# Altium schematic sheet STM3205P_Connectors.SchDoc
size A3; Organization: Canis Tech; Address1: -; Address2: -; Address3: -; Address4: Indaiatuba/SP; DocumentNumber: 2; SheetNumber: 2; SheetTotal: 9; Address5: Brazil
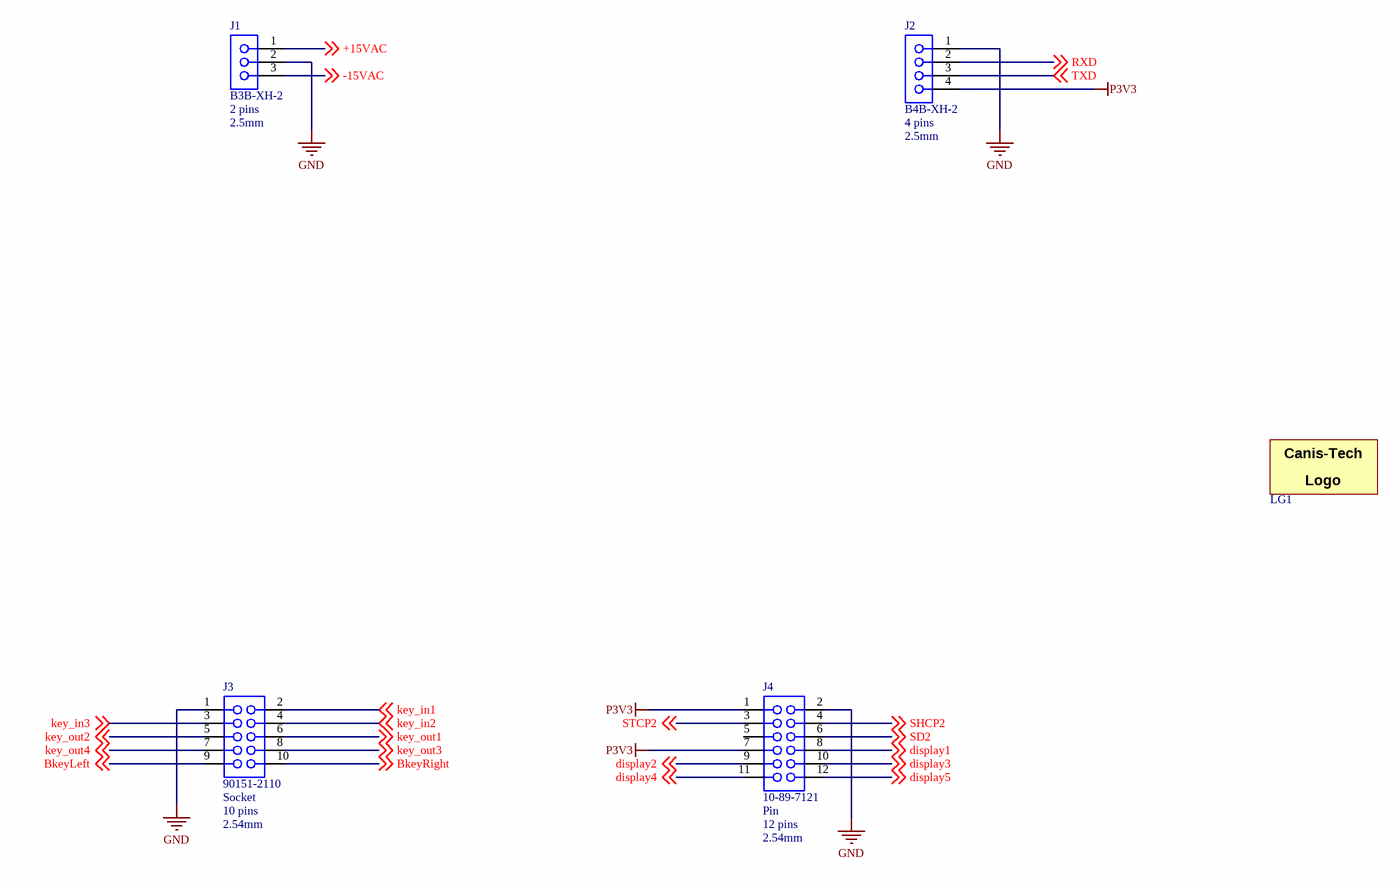
[diagram p0: STM3205P_Connectors.SchDoc]

## Parts
J1  Pins: 2 pins  Pitch: 2.5mm  [CONXH03STRMALE_2.5]  (hidden comment: B3B-XH-2)
J2  Pins: 4 pins  Pitch: 2.5mm  [CONXH04STRMALE_2.5]  (hidden comment: B4B-XH-2)
J3  Type: Socket  Pins: 10 pins  Pitch: 2.54mm  [CONDIL10STRFEMALE_100_100]  (hidden comment: 90151-2110)
J4  Type: Pin  Pins: 12 pins  Pitch: 2.54mm  [CONDIL12STRMALE_100_100]  (hidden comment: 10-89-7121)
LG1  Canis-Tech Logo  [CT Logo 400th]  (value not drawn)  (no BOM)

## Nets
GND: J1.2 J2.1 J3.1 J4.2
P3V3: J2.4 J4.1 J4.7
+15VAC: J1.1 ; off-sheet +15VAC
-15VAC: J1.3 ; off-sheet -15VAC
BkeyLeft: J3.9 ; off-sheet BkeyLeft
BkeyRight: J3.10 ; off-sheet BkeyRight
display1: J4.8 ; off-sheet display1
display2: J4.9 ; off-sheet display2
display3: J4.10 ; off-sheet display3
display4: J4.11 ; off-sheet display4
display5: J4.12 ; off-sheet display5
key_in1: J3.2 ; off-sheet key_in1
key_in2: J3.4 ; off-sheet key_in2
key_in3: J3.3 ; off-sheet key_in3
key_out1: J3.6 ; off-sheet key_out1
key_out2: J3.5 ; off-sheet key_out2
key_out3: J3.8 ; off-sheet key_out3
key_out4: J3.7 ; off-sheet key_out4
RXD: J2.2 ; off-sheet RXD
SD2: J4.6 ; off-sheet SD2
SHCP2: J4.4 ; off-sheet SHCP2
STCP2: J4.3 ; off-sheet STCP2
TXD: J2.3 ; off-sheet TXD

Not connected (* = marked no-connect by the designer): J4 5

## Notes on the sheet
- Title
- Author
- Checked By
- Variant
- Size:
- Revision:
- A3
- Date:
- Project
- Time:
- Sheet
- of
- File:
- (in symbol Canis-Tech Logo) Canis-Tech; Logo

## Library data of the parts
J1 = B3B-XH-2: XH Connector 3 POS HDR VERT 2.5mm; Manufacturer1: JST; LastRevisionNote: Created; Gender: Male; Published: 04-Oct-2025; LatestRevisionDate: 04-Oct-2025; PackageReference: CONXH03STRMALE_2.5; Publisher: Lucas Moraes; PackageDescription: CONXH03STRMALE_2.5; 3 Leads; Type: Pin; PartNumber1: B3B-XH-2
J2 = B4B-XH-2: XH Connector 4 POS HDR VERT 2.5mm; Manufacturer1: JST; LastRevisionNote: Created; Gender: Male; Published: 04-Oct-2025; LatestRevisionDate: 04-Oct-2025; PackageReference: CONXH04STRMALE_2.5; Publisher: Lucas Moraes; PackageDescription: CONXH04STRMALE_2.5; 4 Leads; Type: Pin; PartNumber1: B4B-XH-2
J3 = 90151-2110: Headers & Wire Housings C-Grid PCB Conn Dual Row Vertical 10Ckt; Manufacturer1: Molex; LastRevisionNote: Created; Gender: Female; Direction: 90; Published: 03-Jan-2025; LatestRevisionDate: 03-Jan-2025; PackageReference: CONDIL10STRFEMALE_100_100; Publisher: Lucas Moraes; PackageDescription: CONDIL10STRFEMALE_100_100; 10 Leads; PartNumber1: 90151-2110
J4 = 10-89-7121: Headers & Wire Housings C-Grid PCB Conn SR V onn SR Vt Tn-A 12Ckt; Manufacturer1: Molex; LastRevisionNote: Created; Gender: Male; Direction: 180; Published: 15-Sep-2017; LatestRevisionDate: 15-Sep-2017; PackageReference: CONDIL12; Publisher: Lucas Moraes; PackageDescription: CONDIL12; 12 Leads; PartNumber1: 10-89-7121
LG1 = Canis-Tech Logo: Published: 14-Jul-2023; LatestRevisionDate: 14-Jul-2023; PackageReference: SEW Logo 100th; Publisher: Lucas Moraes; PackageDescription: SEW Logo 100th; No Leads